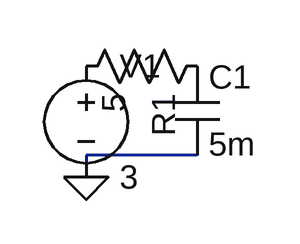
[diagram p0: schematic code.asc]
code.asc, the LTspice schematic file:
Version 4
SHEET 1 880 680
SYMBOL voltage 100 184 R0
SYMATTR InstName V1
SYMATTR Value 3
SYMBOL res 196 184 R90
SYMATTR InstName R1
SYMATTR Value 5
SYMBOL cap 164 200 R0
SYMATTR InstName C1
SYMATTR Value 5m
WIRE 180 264 100 264
WIRE 100 264 100 280
FLAG 100 280 0

The netlist it stands for:
* code.asc
V1 P001 0 3
R1 P002 P001 5
C1 P002 0 5m
.backanno
.end